# EAGLE schematic uMouse_prototype (EAGLE 8.2.0)

## Sheet 1 of 2
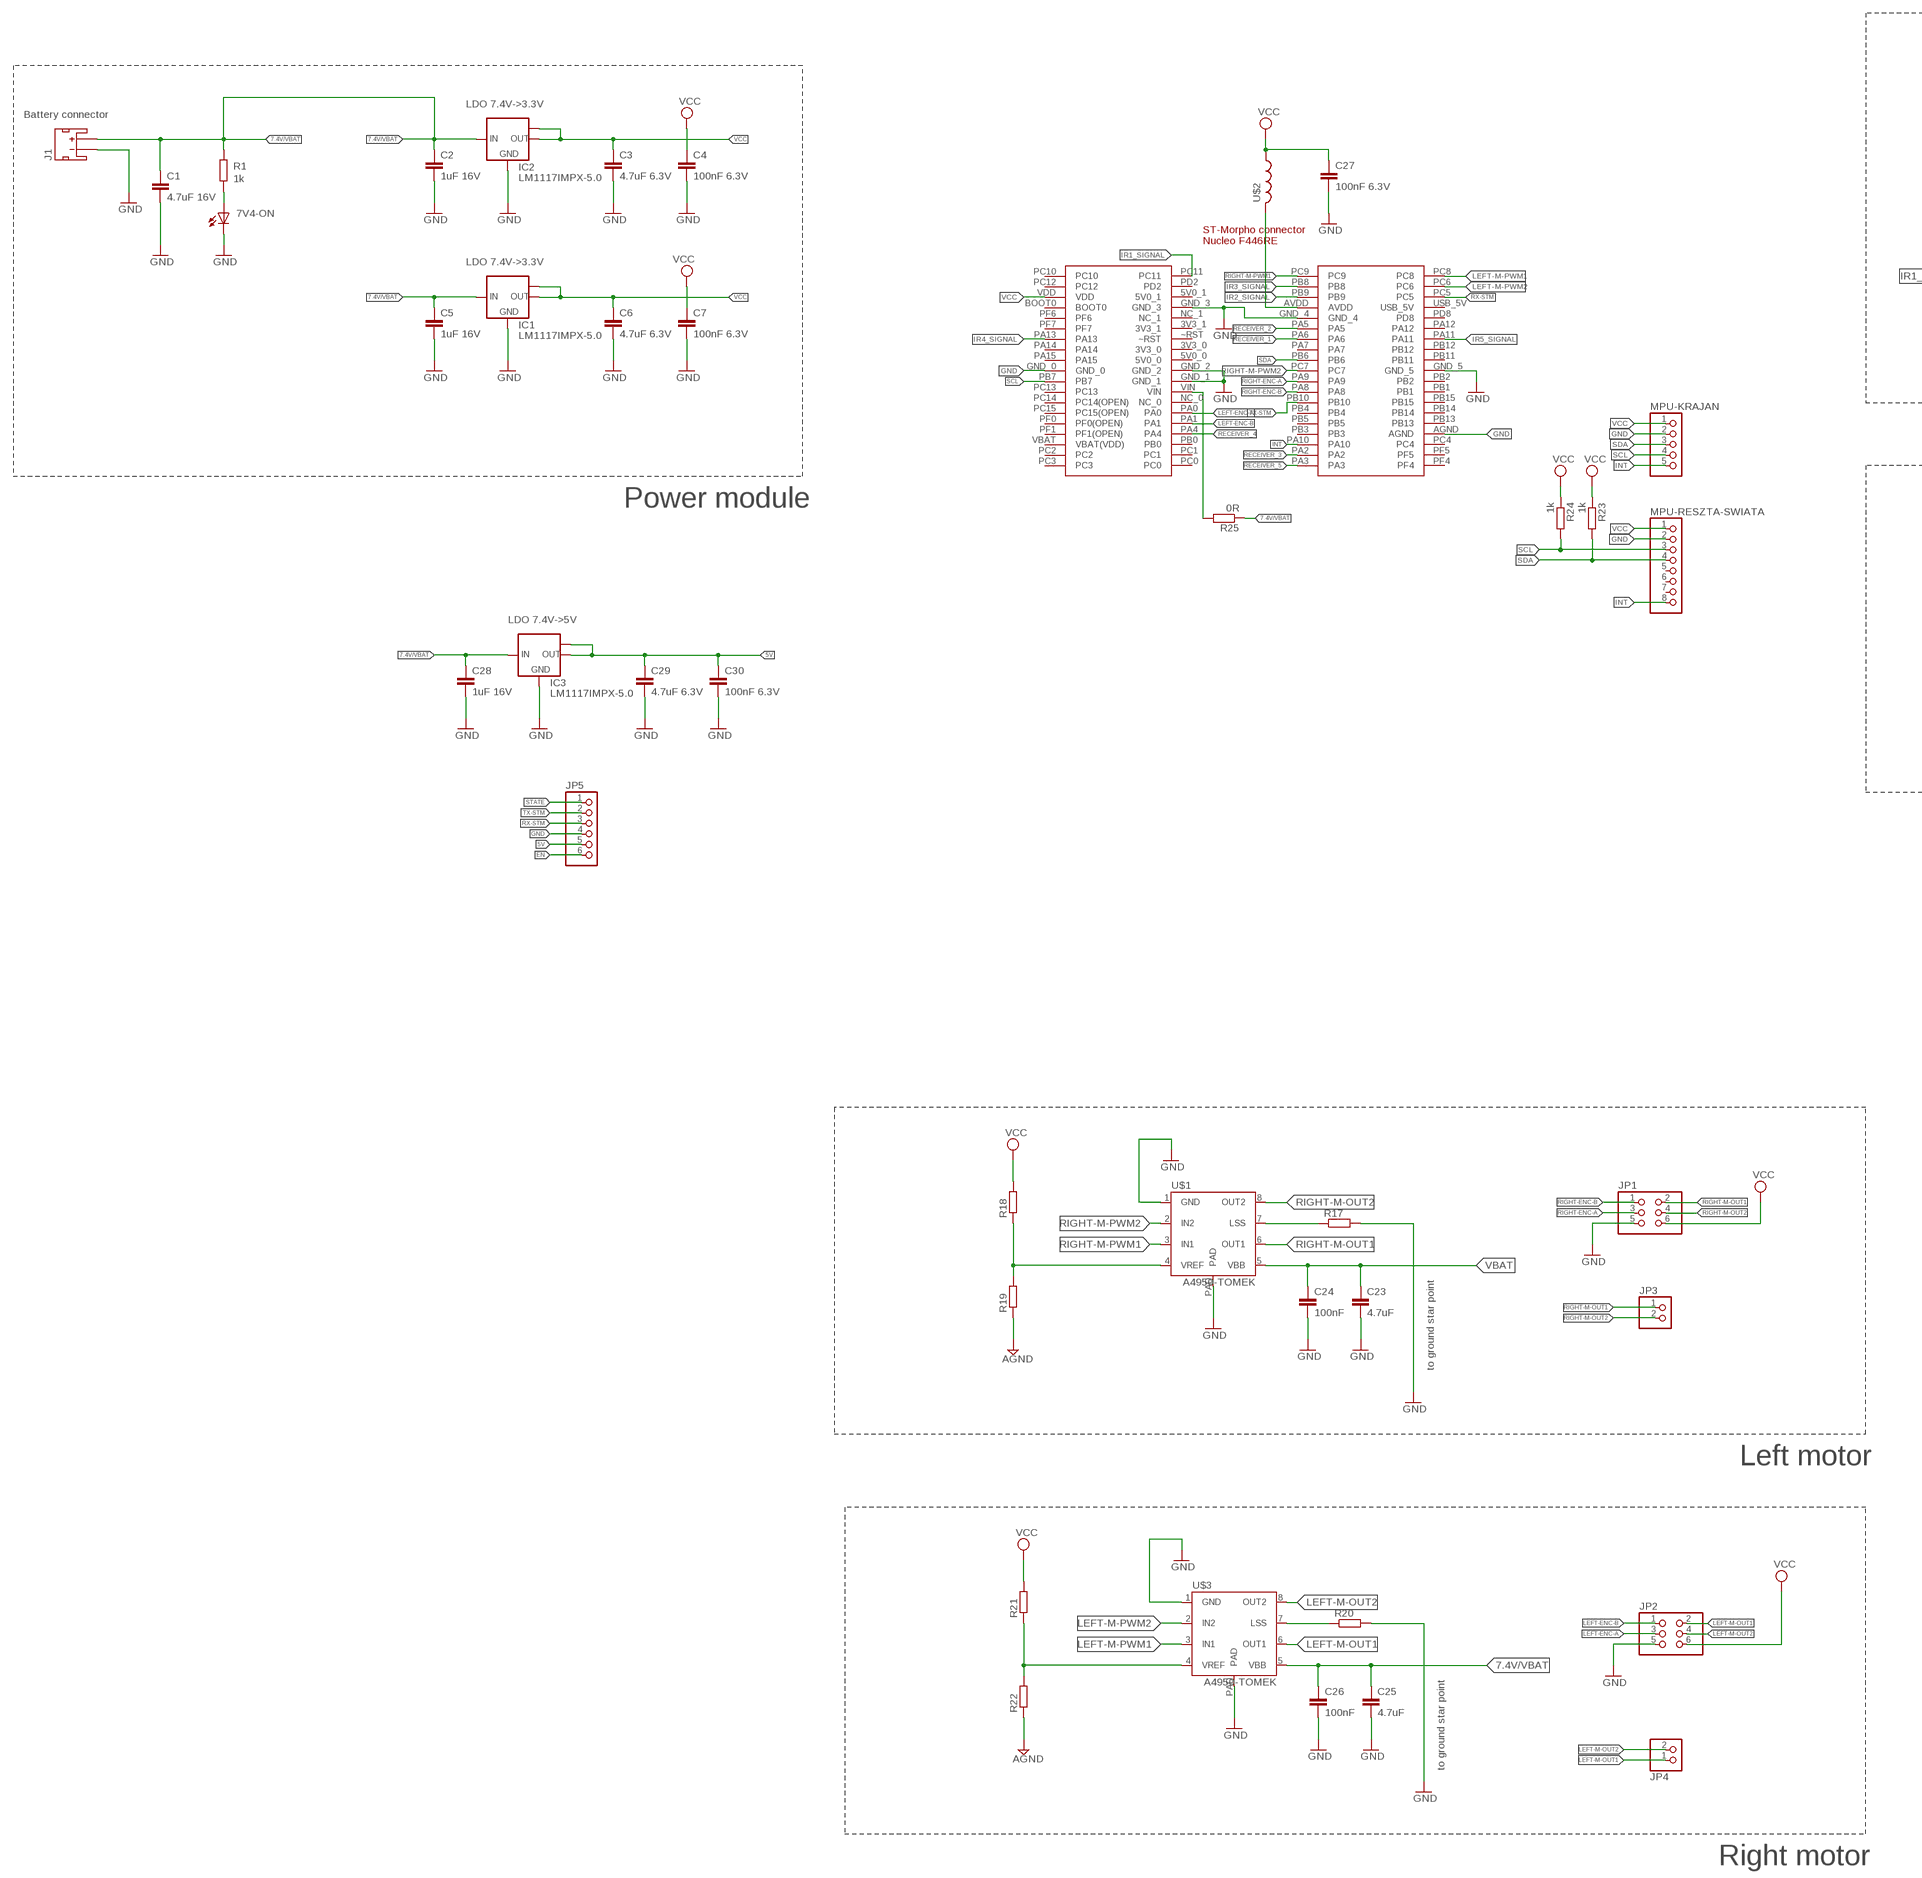
[diagram p0: schematic, sheet 1, part 1 of 2]
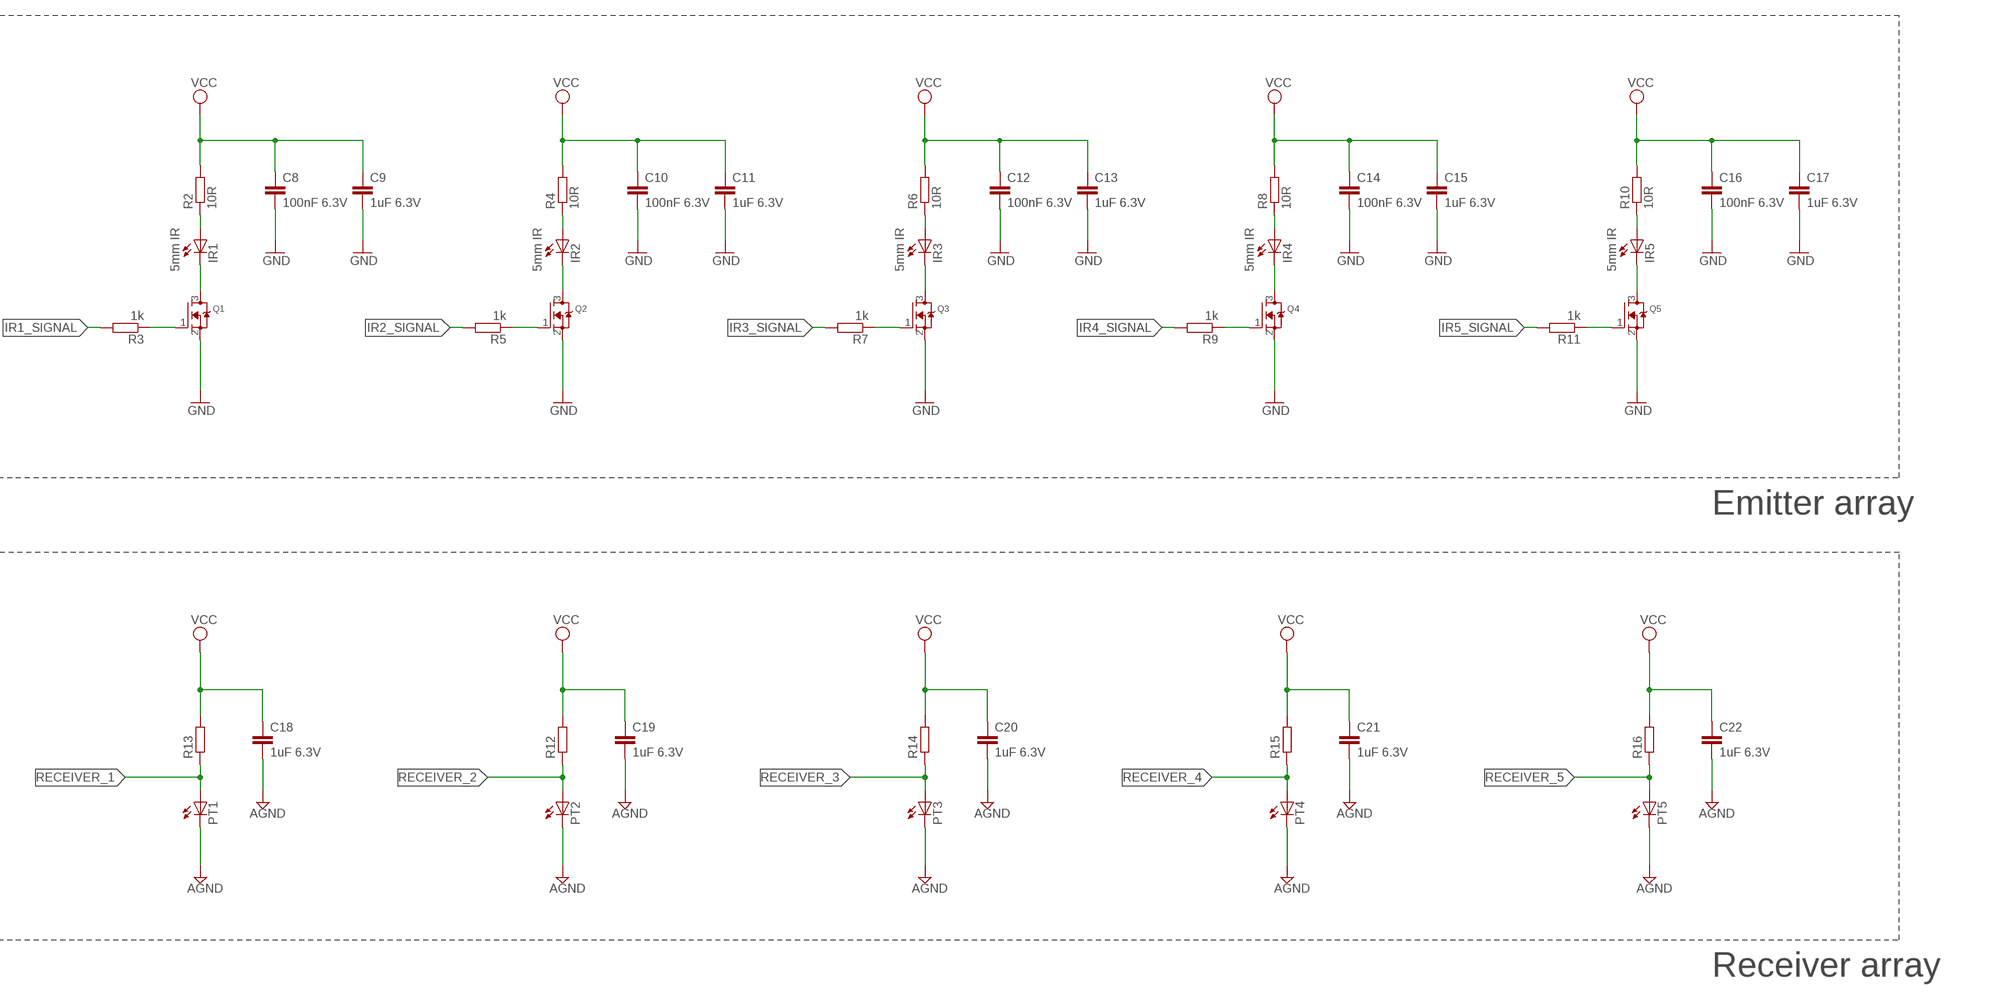
[diagram p1: schematic, sheet 1, part 2 of 2]

### Parts
7V4-ON  LEDCHIP-LED0805  [CHIP-LED0805]
C1  4.7uF 16V  C-EUC0805K  [C0805K]
C2  1uF 16V  C-EUC0805K  [C0805K]
C3  4.7uF 6.3V  C-EUC0805K  [C0805K]
C4  100nF 6.3V  C-EUC0805K  [C0805K]
C5  1uF 16V  C-EUC0805K  [C0805K]
C6  4.7uF 6.3V  C-EUC0805K  [C0805K]
C7  100nF 6.3V  C-EUC0805K  [C0805K]
C8  100nF 6.3V  C-EUC0805K  [C0805K]
C9  1uF 6.3V  C-EUC0805K  [C0805K]
C10  100nF 6.3V  C-EUC0805K  [C0805K]
C11  1uF 6.3V  C-EUC0805K  [C0805K]
C12  100nF 6.3V  C-EUC0805K  [C0805K]
C13  1uF 6.3V  C-EUC0805K  [C0805K]
C14  100nF 6.3V  C-EUC0805K  [C0805K]
C15  1uF 6.3V  C-EUC0805K  [C0805K]
C16  100nF 6.3V  C-EUC0805K  [C0805K]
C17  1uF 6.3V  C-EUC0805K  [C0805K]
C18  1uF 6.3V  C-EUC0805K  [C0805K]
C19  1uF 6.3V  C-EUC0805K  [C0805K]
C20  1uF 6.3V  C-EUC0805K  [C0805K]
C21  1uF 6.3V  C-EUC0805K  [C0805K]
C22  1uF 6.3V  C-EUC0805K  [C0805K]
C23  4.7uF  C-EUC0805K  [C0805K]
C24  100nF  C-EUC0805K  [C0805K]
C25  4.7uF  C-EUC0805K  [C0805K]
C26  100nF  C-EUC0805K  [C0805K]
C27  100nF 6.3V  C-EUC0805K  [C0805K]
C28  1uF 16V  C-EUC0805K  [C0805K]
C29  4.7uF 6.3V  C-EUC0805K  [C0805K]
C30  100nF 6.3V  C-EUC0805K  [C0805K]
IC1  LM1117IMPX-5.0  [SOT223]
IC2  LM1117IMPX-5.0  [SOT223]
IC3  LM1117IMPX-5.0  [SOT223]
IR1  5mm IR  LED5MM  [LED5MM]
IR2  5mm IR  LED5MM  [LED5MM]
IR3  5mm IR  LED5MM  [LED5MM]
IR4  5mm IR  LED5MM  [LED5MM]
IR5  5mm IR  LED5MM  [LED5MM]
J1  JST_2MM_MALE  [JST-2-SMD]
JP1  PINHD-2X3  [2X03]
JP2  PINHD-2X3  [2X03]
JP3  PINHD-1X2  [1X02]
JP4  PINHD-1X2  [1X02]
JP5  PINHD-1X6  [1X06]
MPU-KRAJAN  PINHD-1X5  [1X05]
MPU-RESZTA-SWIATA  PINHD-1X8  [1X08]
PT1  LED3MM  [LED3MM]
PT2  LED3MM  [LED3MM]
PT3  LED3MM  [LED3MM]
PT4  LED3MM  [LED3MM]
PT5  LED3MM  [LED3MM]
Q1  MOSFET-NREFLOW  [SOT23]
Q2  MOSFET-NREFLOW  [SOT23]
Q3  MOSFET-NREFLOW  [SOT23]
Q4  MOSFET-NREFLOW  [SOT23]
Q5  MOSFET-NREFLOW  [SOT23]
R1  1k  R-EU_R0805  [R0805]
R2  10R  R-EU_M0805  [M0805]
R3  1k  R-EU_M0805  [M0805]
R4  10R  R-EU_M0805  [M0805]
R5  1k  R-EU_M0805  [M0805]
R6  10R  R-EU_M0805  [M0805]
R7  1k  R-EU_M0805  [M0805]
R8  10R  R-EU_M0805  [M0805]
R9  1k  R-EU_M0805  [M0805]
R10  10R  R-EU_M0805  [M0805]
R11  1k  R-EU_M0805  [M0805]
R12  R-EU_R0805  [R0805]
R13  R-EU_R0805  [R0805]
R14  R-EU_R0805  [R0805]
R15  R-EU_R0805  [R0805]
R16  R-EU_R0805  [R0805]
R17  R-EU_R2512  [R2512]
R18  R-EU_R0805  [R0805]
R19  R-EU_R0805  [R0805]
R20  R-EU_R2512  [R2512]
R21  R-EU_R0805  [R0805]
R22  R-EU_R0805  [R0805]
R23  1k  R-EU_M0805  [M0805]
R24  1k  R-EU_M0805  [M0805]
R25  0R  R-EU_M0805  [M0805]
U$1  A4950-TOMEK  [SOIC8TP]
U$2  INDUCTOR_0805_L  [RESC0805_L]
U$3  A4950-TOMEK  [SOIC8TP]
U$5  ST_MORPHO_STM32_F446RE  [MORPHO-4X19]

### Nets
5V: C29.1 C30.1 IC3.2(OUT) IC3.TAB(OUT1) JP5.5
7.4V/VBAT: C1.1 C2.1 C5.1 C25.1 C26.1 C28.1 IC1.3(IN) IC2.3(IN) IC3.3(IN) J1.2(+) R1.2 R25.1 U$3.5(VBB)
EN: JP5.6
GND: 7V4-ON.C C1.2 C2.2 C3.2 C4.2 C5.2 C6.2 C7.2 C8.2 C9.2 C10.2 C11.2 C12.2 C13.2 C14.2 C15.2 C16.2 C17.2 C18.2 C19.2 C20.2 C21.2 C22.2 C23.2 C24.2 C25.2 C26.2 C27.2 C28.2 C29.2 C30.2 IC1.1(GND) IC2.1(GND) IC3.1(GND) J1.1(-) JP1.5 JP2.5 JP5.4 MPU-KRAJAN.2 MPU-RESZTA-SWIATA.2 PT1.K(C) PT2.K(C) PT3.K(C) PT4.K(C) PT5.K(C) Q1.2(S) Q2.2(S) Q3.2(S) Q4.2(S) Q5.2(S) R17.2 R19.1 R20.2 R22.1 U$1.1(GND) U$1.PAD U$3.1(GND) U$3.PAD U$5.AGND U$5.GND_0 U$5.GND_1 U$5.GND_2 U$5.GND_3 U$5.GND_4 U$5.GND_5 ; supply symbol labelled AGND
INT: MPU-KRAJAN.5 MPU-RESZTA-SWIATA.8 U$5.PA10
IR1_SIGNAL: R3.2 U$5.PC11
IR2_SIGNAL: R5.2 U$5.PB9
IR3: IR3.K(C) Q3.3(D)
IR3_SIGNAL: R7.2 U$5.PB8
IR4_SIGNAL: R9.2 U$5.PA13
IR5_SIGNAL: R11.2 U$5.PA11
LEFT-ENC-A: JP2.3 U$5.PA0
LEFT-ENC-B: JP2.1 U$5.PA1
LEFT-M-OUT1: JP2.2 JP4.1 U$3.6(OUT1)
LEFT-M-OUT2: JP2.4 JP4.2 U$3.8(OUT2)
LEFT-M-PWM1: U$3.3(IN1) U$5.PC8
LEFT-M-PWM2: U$3.2(IN2) U$5.PC6
N$1: 7V4-ON.A R1.1
N$2: Q1.1(G) R3.1
N$3: IR1.A R2.1
N$4: IR1.K(C) Q1.3(D)
N$5: Q2.1(G) R5.1
N$6: IR2.A R4.1
N$7: IR2.K(C) Q2.3(D)
N$8: Q3.1(G) R7.1
N$9: IR3.A R6.1
N$11: Q4.1(G) R9.1
N$12: IR4.A R8.1
N$13: IR4.K(C) Q4.3(D)
N$14: Q5.1(G) R11.1
N$15: IR5.A R10.1
N$16: IR5.K(C) Q5.3(D)
N$17: R17.1 U$1.7(LSS)
N$18: R18.1 R19.2 U$1.4(VREF)
N$19: R20.1 U$3.7(LSS)
N$20: R21.1 R22.2 U$3.4(VREF)
N$22: U$2.2 U$5.AVDD
N$28: R25.2 U$5.VIN
RECEIVER_1: PT1.A R13.1 U$5.PA6
RECEIVER_2: PT2.A R12.1 U$5.PA5
RECEIVER_3: PT3.A R14.1 U$5.PA2
RECEIVER_4: PT4.A R15.1 U$5.PA4
RECEIVER_5: PT5.A R16.1 U$5.PA3
RIGHT-ENC-A: JP1.3 U$5.PA9
RIGHT-ENC-B: JP1.1 U$5.PA8
RIGHT-M-OUT1: JP1.2 JP3.1 U$1.6(OUT1)
RIGHT-M-OUT2: JP1.4 JP3.2 U$1.8(OUT2)
RIGHT-M-PWM1: U$1.3(IN1) U$5.PC9
RIGHT-M-PWM2: U$1.2(IN2) U$5.PC7
RX-STM: JP5.3 U$5.PC5
SCL: MPU-KRAJAN.4 MPU-RESZTA-SWIATA.3 R24.2 U$5.PB7
SDA: MPU-KRAJAN.3 MPU-RESZTA-SWIATA.4 R23.2 U$5.PB6
STATE: JP5.1
TX-STM: JP5.2 U$5.PB10
VBAT: C23.1 C24.1 U$1.5(VBB)
VCC: C3.1 C4.1 C6.1 C7.1 C8.1 C9.1 C10.1 C11.1 C12.1 C13.1 C14.1 C15.1 C16.1 C17.1 C18.1 C19.1 C20.1 C21.1 C22.1 C27.1 IC1.2(OUT) IC1.TAB(OUT1) IC2.2(OUT) IC2.TAB(OUT1) JP1.6 JP2.6 MPU-KRAJAN.1 MPU-RESZTA-SWIATA.1 R2.2 R4.2 R6.2 R8.2 R10.2 R12.2 R13.2 R14.2 R15.2 R16.2 R18.2 R21.2 R23.1 R24.1 U$2.1 U$5.VDD
Unconnected: J1.NC1(PAD1) J1.NC2(PAD2) MPU-RESZTA-SWIATA.5 MPU-RESZTA-SWIATA.6 MPU-RESZTA-SWIATA.7 U$5.3V3_0 U$5.3V3_1 U$5.5V0_0 U$5.5V0_1 U$5.BOOT0 U$5.NC_0 U$5.NC_1 U$5.PA7 U$5.PA12 U$5.PA14 U$5.PA15 U$5.PB0 U$5.PB1 U$5.PB2 U$5.PB3 U$5.PB4 U$5.PB5 U$5.PB11 U$5.PB12 U$5.PB13 U$5.PB14 U$5.PB15 U$5.PC0 U$5.PC1 U$5.PC2 U$5.PC3 U$5.PC4 U$5.PC10 U$5.PC12 U$5.PC13 U$5.PC14(PC14(OPEN)) U$5.PC15(PC15(OPEN)) U$5.PD2 U$5.PD8 U$5.PF0(PF0(OPEN)) U$5.PF1(PF1(OPEN)) U$5.PF4 U$5.PF5 U$5.PF6 U$5.PF7 U$5.USB_5V U$5.VBAT(VBAT(VDD)) U$5.~RST

### Notes on the sheet
- LDO 7.4V->3.3V
- Battery connector
- LDO 7.4V->3.3V
- Emitter array
- Power module
- LDO 7.4V->5V
- Receiver array
- to ground star point
- Left motor
- to ground star point
- Right motor

## Sheet 2 of 2

## Library data of the parts
7V4-ON IR1-IR5 PT1-PT5 = adafruit:LED: LED OSRAM: - CHIPLED LG R971, LG N971, LY N971, LG Q971, LY Q971, LO R971, LY R971 LH N974, LH R974 LS Q976, LO Q976, LY Q976 LO Q996 - Hyper CHIPLED LW Q18S LB Q993, LB Q99A, LB R99A - SideLED LS A670, LO A670, LY A670, LG A670, LP A670 LB A673, LV A673, LT A673, LW A673 LH A674 LY A675 LS A676, LA A676, LO A676, LY A676, LW A676 LS A679, LY A679, LG A679 - Hyper Micro SIDELED® LS Y876, LA Y876, LO Y876, LY Y876 LT Y87S - SmartLED LW L88C, LW L88S LB L89C, LB L89S, LG L890 LS L89K, LO L89K, LY L89K LS L896, LA L896, LO L896, LY L896 - TOPLED LS T670, LO T670, LY T670, LG T670, LP T670 LSG T670, LSP T670, LSY T670, LOP T670, LYG T670 LG T671, LOG T671, LSG T671 LB T673, LV T673, LT T673, LW T673 LH T674 LS T676, LA T676, LO T676, LY T676, LB T676, LH T676, LSB T676, LW T676 LB T67C, LV T67C, LT T67C, LS T67K, LO T67K, LY T67K, LW E67C LS E67B, LA E67B, LO E67B, LY E67B, LB E67C, LV E67C, LT E67C LW T67C LS T679, LY T679, LG T679 LS T770, LO T770, LY T770, LG T770, LP T770 LB T773, LV T773, LT T773, LW T773 LH T774 LS E675, LA E675, LY E675, LS T675 LS T776, LA T776, LO T776, LY T776, LB T776 LHGB T686 LT T68C, LB T68C - Hyper Mini TOPLED® LB M676 - Mini TOPLED Santana® LG M470 LS M47K, LO M47K, LY M47K Source: http://www.osram.convergy.de/
C1-C30 = rcl:C-EU: CAPACITOR, European symbol
IC1-IC3 = lm1117:LM1117IMPX-*
J1 = SparkFun-Connectors:JST_2MM_MALE: JST 2MM MALE RA CONNECTOR Two pin, compact surface mount connector. Commonly used as a battery input connection point. We really like the solid locking feeling and high current rating on these small connectors. We use these all the time as battery connectors. Mates to single-cell LiPo batteries. Here is the connector we sell at SparkFun: JST Right Angle Connector - White <https://www.sparkfun.com/products/8612> (PRT-08612) Datasheet <http://www.sparkfun.com/datasheets/Prototyping/Connectors/JST-Horizontal.pdf> It was used on these SparkFun products: SparkFun MOSFET Power Controller <https://www.sparkfun.com/products/11214> (PRT-11214) SparkFun Battery Babysitter - LiPo Battery Manager <https://www.sparkfun.com/products/13777> (PRT-13777) And many, many others that required a lipo battery connection.; PROD_ID: CONN-11443; SF_ID: PRT-08612
JP1 JP2 = pinhead:PINHD-2X3: PIN HEADER
JP3 JP4 = pinhead:PINHD-1X2: PIN HEADER
JP5 = pinhead:PINHD-1X6: PIN HEADER
MPU-KRAJAN = pinhead:PINHD-1X5: PIN HEADER
MPU-RESZTA-SWIATA = pinhead:PINHD-1X8: PIN HEADER
Q1-Q5 = adafruit:MOSFET-N: N-Channel Mosfet 2N7002E - 60V 260mA SOT23 [Digikey: 2N7002ET1GOSTR-ND] - REEL BSH103 - 30V 850mA SOT23 [Digikey: 568-5013-1-ND]
R1 = resistor:R-EU_: RESISTOR, European symbol
R2-R25 = rcl:R-EU_: RESISTOR, European symbol
U$1 U$3 = allegro_a4950:A4950-TOMEK
U$2 = Nordic_nRF:INDUCTOR: Generic chip inductor
U$5 = st-morpho:ST_MORPHO_STM32_F446RE

## Net classes
0 default: width 0.305 mm, drill 0.508 mm, clearance 0.254 mm